# EasyEDA Pro project 2025_08_22_io.epro

# Schematic Schematic1
Board Name: Board1; Create Date: 2025-08-22; Page Name: P1; Project Name: 2025_08_22_io; Schematic Name: Schematic1; Update Date: 2025-08-22; Company: EasyEDA.com; Page Size: A4; Version: V1.0
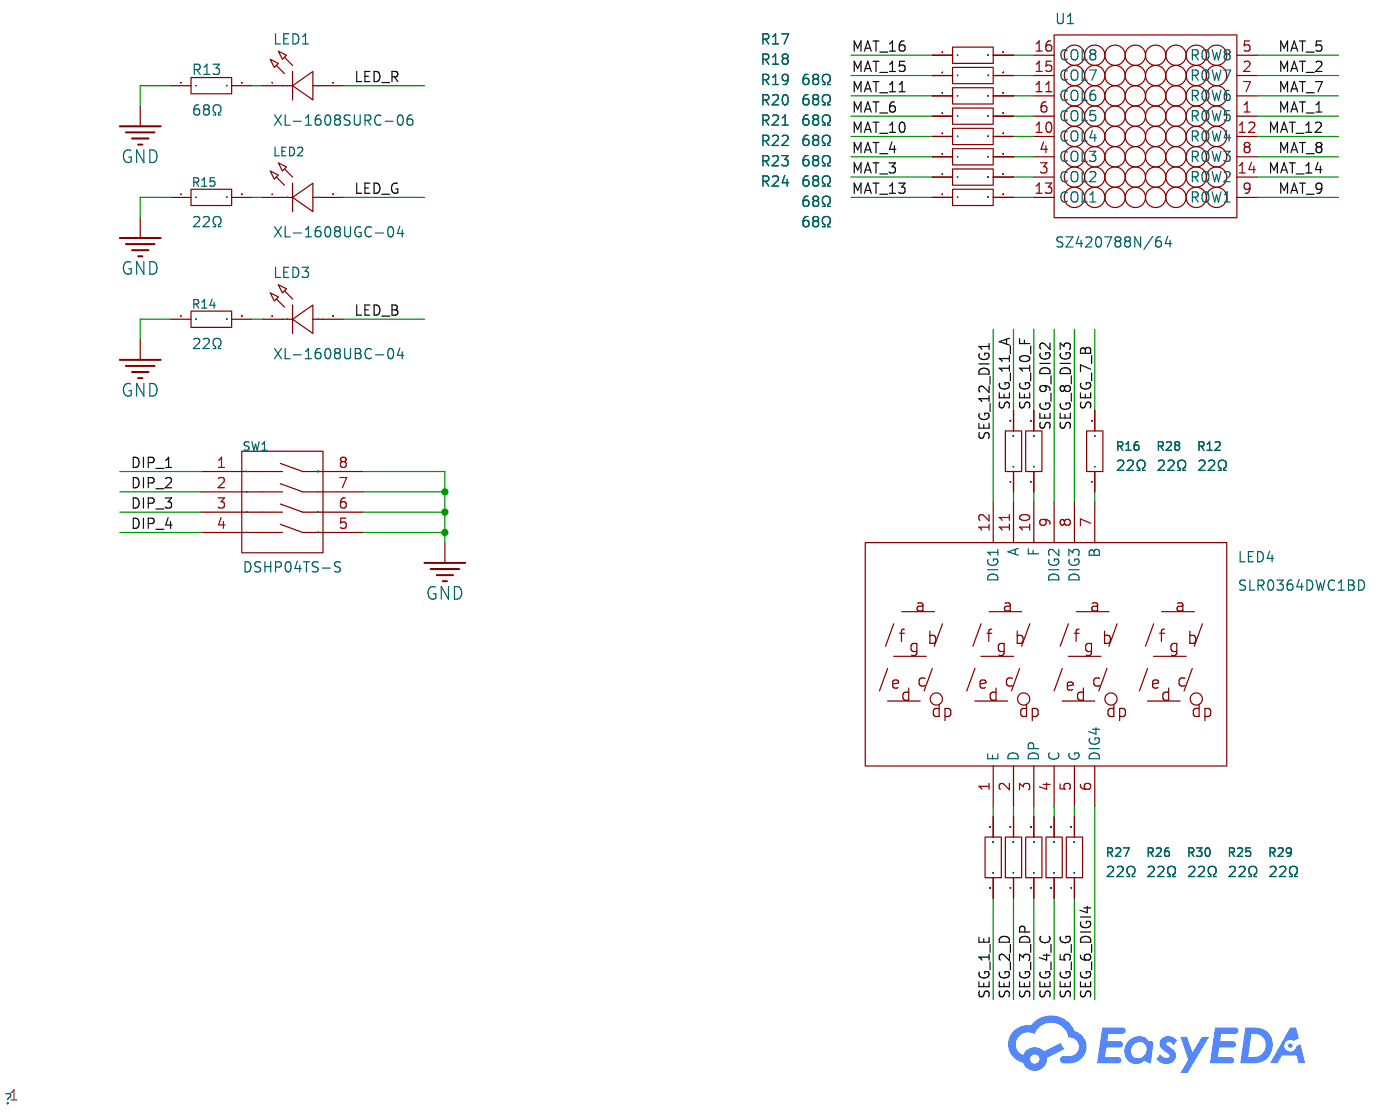
[diagram p0: schematic sheet]

## Parts
LED1  XL-1608SURC-06  [LED0603-RD_RED]
LED2  XL-1608UGC-04  [LED0603-RD_GREEN]
LED3  XL-1608UBC-04  [LED0603-RD_BLUE]
LED4  SLR0364DWC1BD  [LED-SEG-TH_12P-L30.0-W14.0-P2.54-S10.16-BL]
R12  22Ω  [R0402]
R13  68Ω  [R0402]
R14  22Ω  [R0402]
R15  22Ω  [R0402]
R16  22Ω  [R0402]
R17  68Ω  [R0402]
R18  68Ω  [R0402]
R19  68Ω  [R0402]
R20  68Ω  [R0402]
R21  68Ω  [R0402]
R22  68Ω  [R0402]
R23  68Ω  [R0402]
R24  68Ω  [R0402]
R25  22Ω  [R0402]
R26  22Ω  [R0402]
R27  22Ω  [R0402]
R28  22Ω  [R0402]
R29  22Ω  [R0402]
R30  22Ω  [R0402]
SW1  DSHP04TS-S  [SW-SMD_8P-L6.7-W5.4-P1.27-LS8.5]
U1  SZ420788N/64  [LED-SEG-TH_SZ420788N-64]

## Library data of the parts
LED1 = XL-1608SURC-06: Lamp Holder Type:- Illumination Color:Red Voltage - Forward(Vf):2.3V Voltage - Forward(Vf):2.3V Power(Watts):50mW Forward Current:20mA Wavelength - Dominant:620nm~630nm Wavelength - Dominant:620nm~630nm Peak Wavelength:625nm Diode Configuration:- Lens Col; Supplier Part: C965799; Manufacturer: XINGLIGHT(成兴光); Supplier Footprint: 0603; JLCPCB Part Class: Extended Part; Datasheet: https://atta.szlcsc.com/upload/public/pdf/source/20250213/F9766CE804AF391355DCDD48DB3E0DAB.pdf; Supplier: LCSC; Illumination Color: Red; Voltage - Forward(Vf): 2.3V; Power(Watts): 50mW; Forward Current: 20mA; Wavelength - Dominant: 620nm~630nm; Peak Wavelength: 625nm; Lens Color: Colorless Transparent Lens; Luminous Intensity: 225mcd; Viewing Angle: 120°; Mounting Sytle: Positive Stick; Operating Temperature: -20℃~+85℃
LED2 = XL-1608UGC-04: Lamp Holder Type:- Illumination Color:Emerald Green Voltage - Forward(Vf):3.3V Voltage - Forward(Vf):3.3V Power(Watts):70mW Forward Current:20mA Wavelength - Dominant:515nm~535nm Wavelength - Dominant:515nm~535nm Peak Wavelength:525nm Diode Configuration:; Supplier Part: C965804; Manufacturer: XINGLIGHT(成兴光); Supplier Footprint: 0603; JLCPCB Part Class: Extended Part; Datasheet: https://item.szlcsc.com/datasheet/XL-1608UGC-04/1051413.html; Supplier: LCSC; Illumination Color: Emerald Green; Voltage - Forward(Vf): 3.3V; Power(Watts): 70mW; Forward Current: 20mA; Wavelength - Dominant: 515nm~535nm; Peak Wavelength: 525nm; Diode Configuration: Discrete Diode; Lens Color: Water Clear; Luminous Intensity: 810mcd; Viewing Angle: 120°; Mounting Style: op View Mount
LED3 = XL-1608UBC-04: Lamp Holder Type:- Illumination Color:Blue Voltage - Forward(Vf):3.3V Voltage - Forward(Vf):3.3V Power(Watts):70mW Forward Current:20mA Wavelength - Dominant:455nm~475nm Wavelength - Dominant:455nm~475nm Peak Wavelength:470nm Diode Configuration:- Lens Co; Supplier Part: C965807; Manufacturer: XINGLIGHT(成兴光); Supplier Footprint: 0603; JLCPCB Part Class: Extended Part; Datasheet: https://item.szlcsc.com/datasheet/XL-1608UBC-04/1051416.html; Supplier: LCSC; Illumination Color: Blue; Voltage - Forward(Vf): 3.3V; Power(Watts): 70mW; Forward Current: 20mA; Wavelength - Dominant: 455nm~475nm; Peak Wavelength: 470nm; Lens Color: Water Clear; Luminous Intensity: 300mcd; Viewing Angle: 120°; Mounting Style: op View Mount
LED4 = SLR0364DWC1BD_C2913068: LCSC Part Name: 0.36英寸,四位,白光,共阴LED数码管,插件; Supplier Part: C2913068; Manufacturer: SUNLIGHT(光华); Supplier Footprint: 插件; JLCPCB Part Class: Extended Part; Datasheet: https://atta.szlcsc.com/upload/public/pdf/source/20180720/C225967_3297741A5E6B17C460BD0355B8BE7FDB.pdf; Supplier: LCSC
R12 R14-R16 R25-R30 = 0402WGF220JTCE: Type:Thick Film Resistors Resistance:22Ω Tolerance:±1% Tolerance:±1% Power(Watts): Overload Voltage (Max): Temperature Coefficient:±100ppm/℃ Temperature Coefficient:±100ppm/℃ Operating Temperature Range:-55℃~+155℃ Operating Temperature Range:-55℃~+155℃; LCSC Part Name: 22Ω ±1% 62.5mW 厚膜电阻; Supplier Part: C25092; Manufacturer: UNI-ROYAL(厚声); Supplier Footprint: 0402; JLCPCB Part Class: Basic Part; Datasheet: https://atta.szlcsc.com/upload/public/pdf/source/20200306/C422600_1E6D84923E4A46A82E41ADD87F860B5C.pdf; Supplier: LCSC; Type: Thick Film Resistors; Tolerance: ±1%; Temperature Coefficient: ±100ppm/℃; Operating Temperature Range: -55℃~+155℃
R13 R17-R24 = RC0402FR-0768RL: Type:Thick Film Resistor Resistance:68Ω Tolerance:±1% Tolerance:±1% Power(Watts):62.5mW Voltage-Supply(Max):50V Temperature Coefficient:±100ppm/℃ Temperature Coefficient:±100ppm/℃ Operating Temperature:-55℃~+155℃ Operating Temperature:-55℃~+155℃; LCSC Part Name: 厚膜电阻 68Ω ±1% 62.5mW; Supplier Part: C163455; Manufacturer: YAGEO(国巨); Supplier Footprint: 0402; JLCPCB Part Class: Extended Part; Datasheet: https://item.szlcsc.com/datasheet/RC0402FR-0768RL/174836.html; Supplier: LCSC; Type: Thick Film Resistor; Tolerance: ±1%; Power(Watts): 62.5mW; Voltage-Supply(Max): 50V; Temperature Coefficient: ±100ppm/℃; Operating Temperature: -55℃~+155℃
SW1 = DSHP04TS-S: Type:平拨,凹槽式 Circuit:SPST Number of Positions:4Bit Pin Style:Gull Wing Lead Pitch:1.27mm Current Rating:25mA Voltage Rating:24V Operating Temperature:-20℃~+70℃ Operating Temperature:-20℃~+70℃ Operating Life:3千次 Color:Black; LCSC Part Name: 间距1.27mm 平拨,凹槽式 4位拨码开关; Supplier Part: C319050; Manufacturer: XKB Connectivity(中国星坤); Supplier Footprint: SMD-8P,5.4x6.7mm; JLCPCB Part Class: Extended Part; Datasheet: https://atta.szlcsc.com/upload/public/pdf/source/20211009/11BE85C99D2C85B0991AF4F9D6EB8BDE.pdf; Supplier: LCSC; Type: 平拨,凹槽式; Circuit: SPST; Number of Positions: 4Bit; Pin Style: Gull Wing; Lead Pitch: 1.27mm; Current Rating: 25mA; Voltage Rating: 24V; Operating Temperature: -20℃~+70℃; Operating Life: 3千次; Color: Black
U1 = SZ420788N/64: Dot Matrix Number:8x8 Emitting Color:Red Polarity:Common Cathode; LCSC Part Name: 8x8位共阴极红色LED点阵; Supplier Part: C2980921; Manufacturer: ARKLED(方舟); Supplier Footprint: 插件; JLCPCB Part Class: Extended Part; Datasheet: https://atta.szlcsc.com/upload/public/pdf/source/20220310/DFED24155EC523E74B6AABE05A84B051.pdf; Supplier: LCSC; Dot Matrix Number: 8x8; Emitting Color: Red; Polarity: Common Cathode

## Nets
GND: R13.1 R14.1 R15.1 SW1.5 SW1.6 SW1.7 SW1.8
DIP_1: SW1.1
DIP_2: SW1.2
DIP_3: SW1.3
DIP_4: SW1.4
LED_B: LED3.2(A)
LED_G: LED2.2(A)
LED_R: LED1.2(A)
MAT_1: U1.1(ROW5)
MAT_2: U1.2(ROW7)
MAT_3: R23.1
MAT_4: R22.1
MAT_5: U1.5(ROW8)
MAT_6: R20.1
MAT_7: U1.7(ROW6)
MAT_8: U1.8(ROW3)
MAT_9: U1.9(ROW1)
MAT_10: R21.1
MAT_11: R19.1
MAT_12: U1.12(ROW4)
MAT_13: R24.1
MAT_14: U1.14(ROW2)
MAT_15: R18.1
MAT_16: R17.1
SEG_1_E: R27.1
SEG_2_D: R26.1
SEG_3_DP: R30.1
SEG_4_C: R25.1
SEG_5_G: R29.1
SEG_6_DIGI4: LED4.6(DIG4)
SEG_7_B: R12.2
SEG_8_DIG3: LED4.8(DIG3)
SEG_9_DIG2: LED4.9(DIG2)
SEG_10_F: R28.2
SEG_11_A: R16.2
SEG_12_DIG1: LED4.12(DIG1)
Net-(LED1-1): LED1.1(K) R13.2
Net-(LED2-1): LED2.1(K) R15.2
Net-(LED3-1): LED3.1(K) R14.2
Net-(LED4-1): LED4.1(E) R27.2
Net-(LED4-2): LED4.2(D) R26.2
Net-(LED4-3): LED4.3(DP) R30.2
Net-(LED4-4): LED4.4(C) R25.2
Net-(LED4-5): LED4.5(G) R29.2
Net-(LED4-7): LED4.7(B) R12.1
Net-(LED4-10): LED4.10(F) R28.1
Net-(LED4-11): LED4.11(A) R16.1
Net-(R17-2): R17.2 U1.16(COL8)
Net-(R18-2): R18.2 U1.15(COL7)
Net-(R19-2): R19.2 U1.11(COL6)
Net-(R20-2): R20.2 U1.6(COL5)
Net-(R21-2): R21.2 U1.10(COL4)
Net-(R22-2): R22.2 U1.4(COL3)
Net-(R23-2): R23.2 U1.3(COL2)
Net-(R24-2): R24.2 U1.13(COL1)
